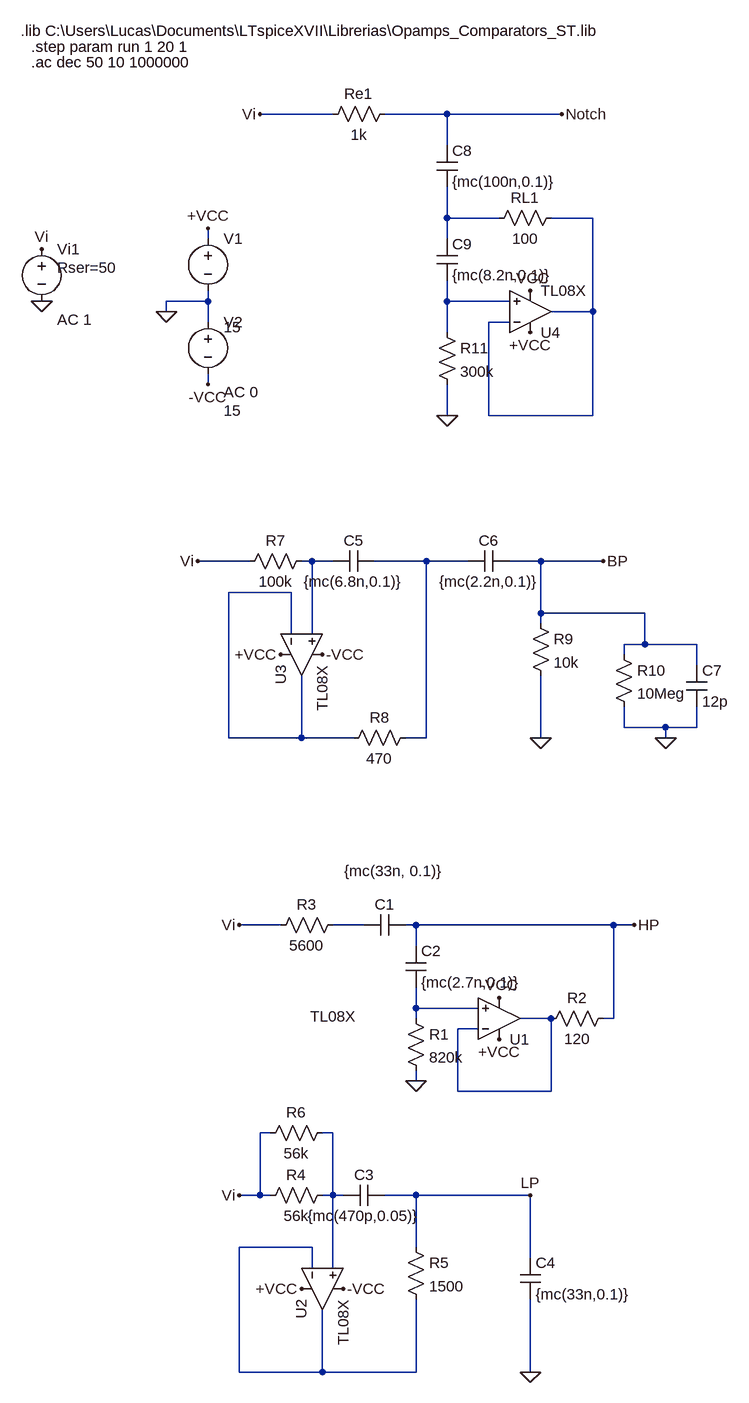
[diagram p0: schematic Todo.asc]
Todo.asc, the LTspice schematic file:
Version 4
SHEET 1 880 680
WIRE 48 -1408 -64 -1408
WIRE 224 -1408 128 -1408
WIRE 400 -1408 224 -1408
WIRE 224 -1360 224 -1408
WIRE 224 -1248 224 -1296
WIRE 304 -1248 224 -1248
WIRE 448 -1248 384 -1248
WIRE -144 -1216 -144 -1232
WIRE 224 -1216 224 -1248
WIRE -144 -1120 -144 -1136
WIRE -144 -1120 -208 -1120
WIRE 224 -1120 224 -1152
WIRE 320 -1120 224 -1120
WIRE -208 -1104 -208 -1120
WIRE 448 -1104 448 -1248
WIRE 448 -1104 384 -1104
WIRE -144 -1088 -144 -1120
WIRE 320 -1088 288 -1088
WIRE 224 -1072 224 -1120
WIRE -144 -992 -144 -1008
WIRE 224 -944 224 -992
WIRE 288 -944 288 -1088
WIRE 448 -944 448 -1104
WIRE 448 -944 288 -944
WIRE -80 -720 -160 -720
WIRE 16 -720 0 -720
WIRE 48 -720 16 -720
WIRE 192 -720 112 -720
WIRE 256 -720 192 -720
WIRE 368 -720 320 -720
WIRE 464 -720 368 -720
WIRE -16 -672 -112 -672
WIRE 368 -640 368 -720
WIRE 528 -640 368 -640
WIRE 368 -624 368 -640
WIRE -16 -608 -16 -672
WIRE 16 -608 16 -720
WIRE 528 -592 528 -640
WIRE 528 -592 496 -592
WIRE 608 -592 528 -592
WIRE 496 -576 496 -592
WIRE 608 -560 608 -592
WIRE 496 -464 496 -496
WIRE 560 -464 496 -464
WIRE 608 -464 608 -496
WIRE 608 -464 560 -464
WIRE -112 -448 -112 -672
WIRE 0 -448 0 -544
WIRE 0 -448 -112 -448
WIRE 80 -448 0 -448
WIRE 192 -448 192 -720
WIRE 192 -448 160 -448
WIRE 368 -448 368 -544
WIRE 560 -448 560 -464
WIRE -32 -160 -96 -160
WIRE 96 -160 48 -160
WIRE 176 -160 160 -160
WIRE 480 -160 176 -160
WIRE 512 -160 480 -160
WIRE 176 -128 176 -160
WIRE 176 -32 176 -64
WIRE 272 -32 176 -32
WIRE 176 -16 176 -32
WIRE 384 -16 336 -16
WIRE 480 -16 480 -160
WIRE 480 -16 464 -16
WIRE 272 0 240 0
WIRE 176 80 176 64
WIRE 240 96 240 0
WIRE 384 96 384 -16
WIRE 384 96 240 96
WIRE -48 160 -64 160
WIRE 48 160 32 160
WIRE -64 256 -64 160
WIRE -64 256 -96 256
WIRE -48 256 -64 256
WIRE 48 256 48 160
WIRE 48 256 32 256
WIRE 64 256 48 256
WIRE 176 256 128 256
WIRE 352 256 176 256
WIRE 16 336 -96 336
WIRE 176 336 176 256
WIRE 352 352 352 256
WIRE 16 368 16 336
WIRE 48 368 48 256
WIRE -96 528 -96 336
WIRE 32 528 32 432
WIRE 32 528 -96 528
WIRE 176 528 176 416
WIRE 176 528 32 528
WIRE 352 528 352 416
FLAG -96 -160 Vi
FLAG 176 80 0
FLAG 304 16 +VCC
FLAG 304 -48 -VCC
FLAG 512 -160 HP
FLAG -96 256 Vi
FLAG 0 400 +VCC
FLAG 64 400 -VCC
FLAG 352 528 0
FLAG 352 256 LP
FLAG 368 -448 0
FLAG -160 -720 Vi
FLAG 464 -720 BP
FLAG -32 -576 +VCC
FLAG 32 -576 -VCC
FLAG 560 -448 0
FLAG 224 -944 0
FLAG -64 -1408 Vi
FLAG 400 -1408 Notch
FLAG -208 -1104 0
FLAG -144 -1232 +VCC
FLAG -144 -992 -VCC
FLAG 352 -1072 +VCC
FLAG 352 -1136 -VCC
FLAG -400 -1200 Vi
FLAG -400 -1120 0
SYMBOL cap 160 -176 R90
WINDOW 0 0 32 VBottom 2
WINDOW 3 -83 18 VTop 2
SYMATTR InstName C1
SYMATTR Value {mc(33n, 0.1)}
SYMBOL cap 160 -128 R0
SYMATTR InstName C2
SYMATTR Value {mc(2.7n,0.1)}
SYMBOL res 160 -32 R0
SYMATTR InstName R1
SYMATTR Value 820k
SYMBOL Opamps\\opamp2 304 48 M180
WINDOW 3 -291 67 Left 2
SYMATTR Value TL08X
SYMATTR InstName U1
SYMBOL res 480 -32 R90
WINDOW 0 0 56 VBottom 2
WINDOW 3 32 56 VTop 2
SYMATTR InstName R2
SYMATTR Value 120
SYMBOL res 64 -176 R90
WINDOW 0 0 56 VBottom 2
WINDOW 3 32 56 VTop 2
SYMATTR InstName R3
SYMATTR Value 5600
SYMBOL Opamps\\opamp2 -32 400 M90
SYMATTR InstName U2
SYMATTR Value TL08X
SYMBOL res 48 240 R90
WINDOW 0 0 56 VBottom 2
WINDOW 3 32 56 VTop 2
SYMATTR InstName R4
SYMATTR Value 56k
SYMBOL cap 128 240 R90
WINDOW 0 0 32 VBottom 2
WINDOW 3 32 32 VTop 2
SYMATTR InstName C3
SYMATTR Value {mc(470p,0.05)}
SYMBOL res 160 320 R0
SYMATTR InstName R5
SYMATTR Value 1500
SYMBOL cap 336 352 R0
SYMATTR InstName C4
SYMATTR Value {mc(33n,0.1)}
SYMBOL res 48 144 R90
WINDOW 0 0 56 VBottom 2
WINDOW 3 32 56 VTop 2
SYMATTR InstName R6
SYMATTR Value 56k
SYMBOL res 16 -736 R90
WINDOW 0 0 56 VBottom 2
WINDOW 3 32 56 VTop 2
SYMATTR InstName R7
SYMATTR Value 100k
SYMBOL cap 112 -736 R90
WINDOW 0 0 32 VBottom 2
WINDOW 3 32 32 VTop 2
SYMATTR InstName C5
SYMATTR Value {mc(6.8n,0.1)}
SYMBOL cap 320 -736 R90
WINDOW 0 0 32 VBottom 2
WINDOW 3 32 32 VTop 2
SYMATTR InstName C6
SYMATTR Value {mc(2.2n,0.1)}
SYMBOL Opamps\\opamp2 -64 -576 M90
SYMATTR InstName U3
SYMATTR Value TL08X
SYMBOL res 176 -464 R90
WINDOW 0 0 56 VBottom 2
WINDOW 3 32 56 VTop 2
SYMATTR InstName R8
SYMATTR Value 470
SYMBOL res 352 -640 R0
SYMATTR InstName R9
SYMATTR Value 10k
SYMBOL res 480 -592 R0
SYMATTR InstName R10
SYMATTR Value 10Meg
SYMBOL cap 592 -560 R0
SYMATTR InstName C7
SYMATTR Value 12p
SYMBOL res 144 -1424 R90
WINDOW 0 0 56 VBottom 2
WINDOW 3 32 56 VTop 2
SYMATTR InstName Re1
SYMATTR Value 1k
SYMBOL cap 208 -1360 R0
SYMATTR InstName C8
SYMATTR Value {mc(100n,0.1)}
SYMBOL cap 208 -1216 R0
SYMATTR InstName C9
SYMATTR Value {mc(8.2n,0.1)}
SYMBOL res 208 -1088 R0
SYMATTR InstName R11
SYMATTR Value 300k
SYMBOL Opamps\\opamp2 352 -1040 M180
SYMATTR InstName U4
SYMATTR Value TL08X
SYMBOL res 400 -1264 R90
WINDOW 0 0 56 VBottom 2
WINDOW 3 32 56 VTop 2
SYMATTR InstName RL1
SYMATTR Value 100
SYMBOL voltage -144 -1232 R0
WINDOW 3 24 152 Left 2
WINDOW 123 24 124 Left 2
WINDOW 39 0 0 Left 0
SYMATTR Value 15
SYMATTR InstName V1
SYMBOL voltage -144 -1104 R0
WINDOW 3 24 152 Left 2
WINDOW 123 24 124 Left 2
WINDOW 39 0 0 Left 0
SYMATTR Value 15
SYMATTR Value2 AC 0
SYMATTR InstName V2
SYMBOL voltage -400 -1216 R0
WINDOW 123 24 124 Left 2
WINDOW 39 24 44 Left 2
SYMATTR Value2 AC 1
SYMATTR SpiceLine Rser=50
SYMATTR InstName Vi1
SYMATTR Value ""
TEXT -432 -1536 Left 2 !.lib C:\\Users\\Lucas\\Documents\\LTspiceXVII\\Librerias\\Opamps_Comparators_ST.lib
TEXT -416 -1488 Left 2 !.ac dec 50 10 1000000
TEXT -416 -1512 Left 2 !.step param run 1 20 1

The netlist it stands for:
* Todo.asc
C1 HP N007 {mc(33n, 0.1)}
C2 HP N008 {mc(2.7n,0.1)}
R1 N008 0 820k
XU1 N008 N009 +VCC -VCC N009 TL08X  ; pins In+ In- V+ V- OUT
R2 HP N009 120
R3 N007 Vi 5600
XU2 N010 N011 +VCC -VCC N011 TL08X  ; pins In+ In- V+ V- OUT
R4 N010 Vi 56k
C3 LP N010 {mc(470p,0.05)}
R5 LP N011 1500
C4 LP 0 {mc(33n,0.1)}
R6 N010 Vi 56k
R7 N004 Vi 100k
C5 N005 N004 {mc(6.8n,0.1)}
C6 BP N005 {mc(2.2n,0.1)}
XU3 N004 N006 +VCC -VCC N006 TL08X  ; pins In+ In- V+ V- OUT
R8 N005 N006 470
R9 BP 0 10k
R10 BP 0 10Meg
C7 BP 0 12p
Re1 Notch Vi 1k
C8 Notch N001 {mc(100n,0.1)}
C9 N001 N003 {mc(8.2n,0.1)}
R11 N003 0 300k
XU4 N003 N002 +VCC -VCC N002 TL08X  ; pins In+ In- V+ V- OUT
RL1 N002 N001 100
V1 +VCC 0 15
V2 0 -VCC 15 AC 0
Vi1 Vi 0 AC 1 Rser=50
.lib C:\Users\Lucas\Documents\LTspiceXVII\Librerias\Opamps_Comparators_ST.lib
.ac dec 50 10 1000000
.step param run 1 20 1
.backanno
.end